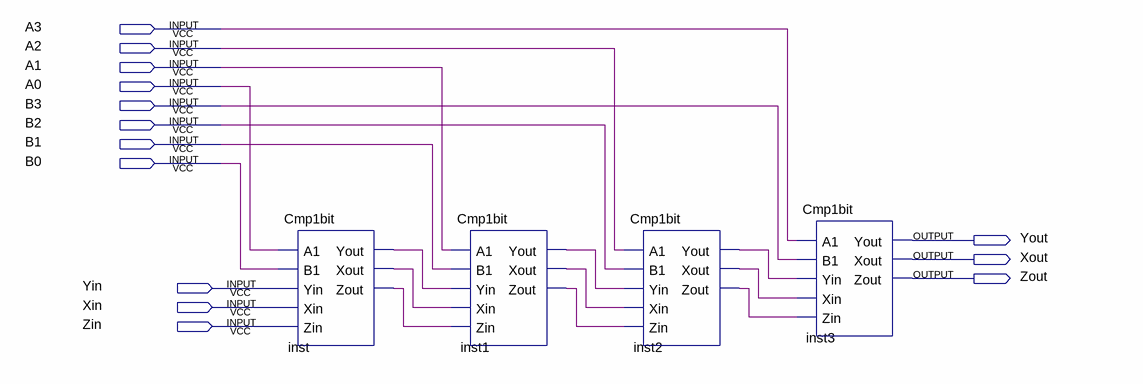
[diagram p0: schematic sheet]
// Quartus schematic Cmp4bit.bdf as structural Verilog: 4 symbols, 14 pins
module Cmp4bit (
  input  A3,
  input  A2,
  input  A1,
  input  A0,
  input  B3,
  input  B2,
  input  B1,
  input  B0,
  input  Yin,
  input  Xin,
  input  Zin,
  output Yout,
  output Xout,
  output Zout
);

  wire inst1_xout, inst1_yout, inst1_zout, inst2_xout, inst2_yout, inst2_zout, inst_xout, inst_yout,
       inst_zout;

  Cmp1bit inst (
    .A1(A0), .B1(B0), .Yin(Yin), .Xin(Xin), .Zin(Zin), .Yout(inst_yout), .Xout(inst_xout), .Zout(inst_zout));
  Cmp1bit inst1 (
    .A1(A1), .B1(B1), .Yin(inst_yout), .Xin(inst_xout), .Zin(inst_zout), .Yout(inst1_yout),
    .Xout(inst1_xout), .Zout(inst1_zout));
  Cmp1bit inst2 (
    .A1(A2), .B1(B2), .Yin(inst1_yout), .Xin(inst1_xout), .Zin(inst1_zout), .Yout(inst2_yout),
    .Xout(inst2_xout), .Zout(inst2_zout));
  Cmp1bit inst3 (
    .A1(A3), .B1(B3), .Yin(inst2_yout), .Xin(inst2_xout), .Zin(inst2_zout), .Yout(Yout), .Xout(Xout),
    .Zout(Zout));
endmodule
